# EAGLE schematic Avionics_Main_Board (EAGLE 9.1.1)

## Sheet 1 of 3
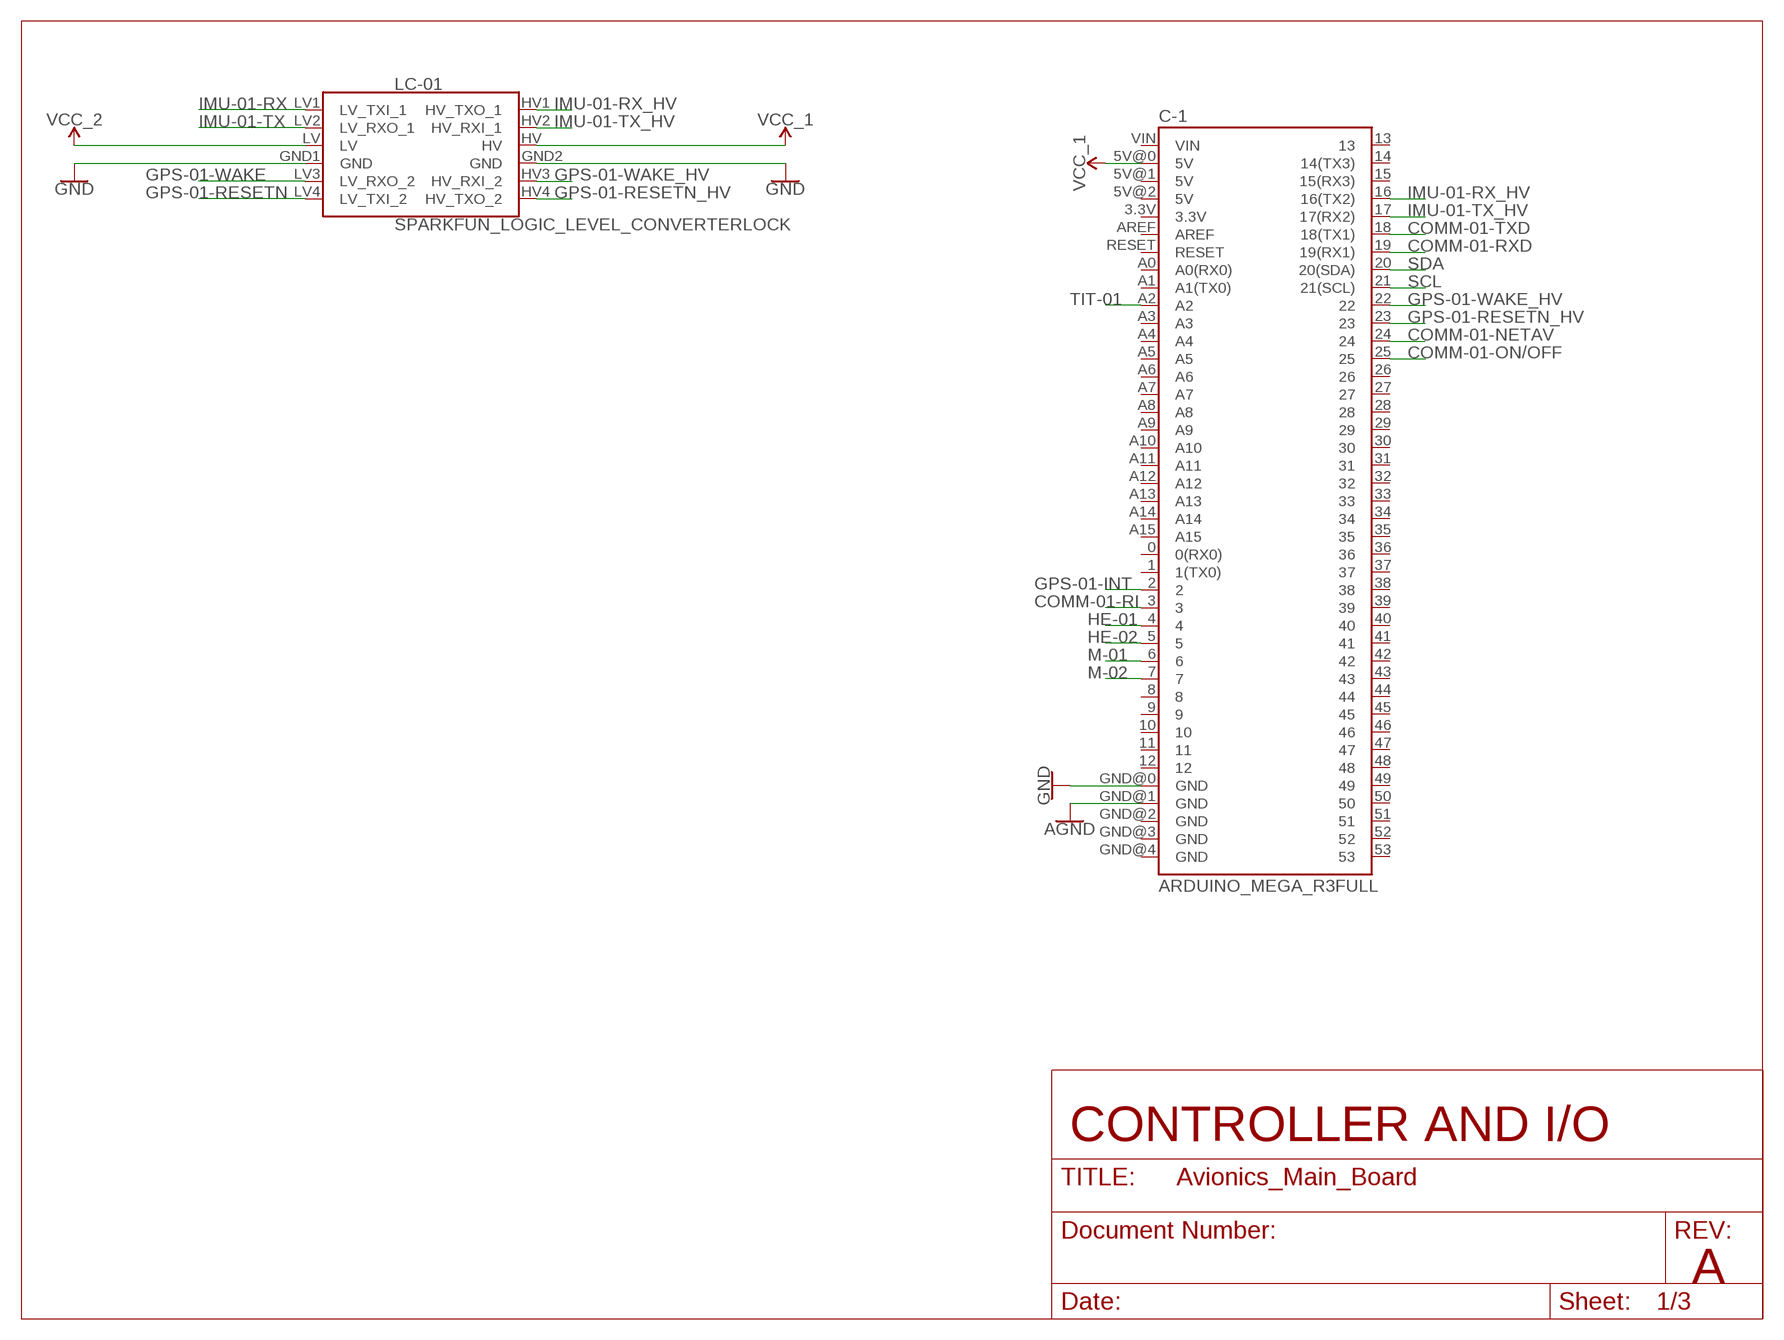
[diagram p0: schematic, sheet 1]

### Parts
C-1  ARDUINO_MEGA_R3FULL  [ARDUINO_MEGA]
LC-01  SPARKFUN_LOGIC_LEVEL_CONVERTERLOCK  [SPARKFUN_LOGIC_LEVEL_CONVERTER_LOCK]

### Nets
AGND: C-1.GND@1(GND) ; also sheet 3
COMM-01-NETAV: C-1.24 ; also sheet 3
COMM-01-ON/OFF: C-1.25 ; also sheet 3
COMM-01-RI: C-1.3 ; also sheet 3
COMM-01-RXD: C-1.19(19(RX1)) ; also sheet 3
COMM-01-TXD: C-1.18(18(TX1)) ; also sheet 3
GND: C-1.GND@0(GND) LC-01.GND1(GND) LC-01.GND2(GND) ; also sheet 2,3
GPS-01-INT: C-1.2 ; also sheet 3
GPS-01-RESETN: LC-01.LV4(LV_TXI_2) ; also sheet 3
GPS-01-RESETN_HV: C-1.23 LC-01.HV4(HV_TXO_2)
GPS-01-WAKE: LC-01.LV3(LV_RXO_2) ; also sheet 3
GPS-01-WAKE_HV: C-1.22 LC-01.HV3(HV_RXI_2)
HE-01: C-1.4 ; also sheet 2
HE-02: C-1.5 ; also sheet 2
IMU-01-RX: LC-01.LV1(LV_TXI_1) ; also sheet 3
IMU-01-RX_HV: C-1.16(16(TX2)) LC-01.HV1(HV_TXO_1)
IMU-01-TX: LC-01.LV2(LV_RXO_1) ; also sheet 3
IMU-01-TX_HV: C-1.17(17(RX2)) LC-01.HV2(HV_RXI_1)
M-01: C-1.6 ; also sheet 2
M-02: C-1.7 ; also sheet 2
SCL: C-1.21(21(SCL)) ; also sheet 3
SDA: C-1.20(20(SDA)) ; also sheet 3
TIT-01: C-1.A2 ; also sheet 3
VCC_1: C-1.5V@0(5V) LC-01.HV ; also sheet 2,3
VCC_2: LC-01.LV ; also sheet 2,3
Unconnected: C-1.0(0(RX0)) C-1.1(1(TX0)) C-1.3.3V C-1.5V@1(5V) C-1.5V@2(5V) C-1.8 C-1.9 C-1.10 C-1.11 C-1.12 C-1.13 C-1.14(14(TX3)) C-1.15(15(RX3)) C-1.26 C-1.27 C-1.28 C-1.29 C-1.30 C-1.31 C-1.32 C-1.33 C-1.34 C-1.35 C-1.36 C-1.37 C-1.38 C-1.39 C-1.40 C-1.41 C-1.42 C-1.43 C-1.44 C-1.45 C-1.46 C-1.47 C-1.48 C-1.49 C-1.50 C-1.51 C-1.52 C-1.53 C-1.A0(A0(RX0)) C-1.A1(A1(TX0)) C-1.A3 C-1.A4 C-1.A5 C-1.A6 C-1.A7 C-1.A8 C-1.A9 C-1.A10 C-1.A11 C-1.A12 C-1.A13 C-1.A14 C-1.A15 C-1.AREF C-1.GND@2(GND) C-1.GND@3(GND) C-1.GND@4(GND) C-1.RESET C-1.VIN

### Notes on the sheet
- CONTROLLER AND I/O
- A

## Sheet 2 of 3
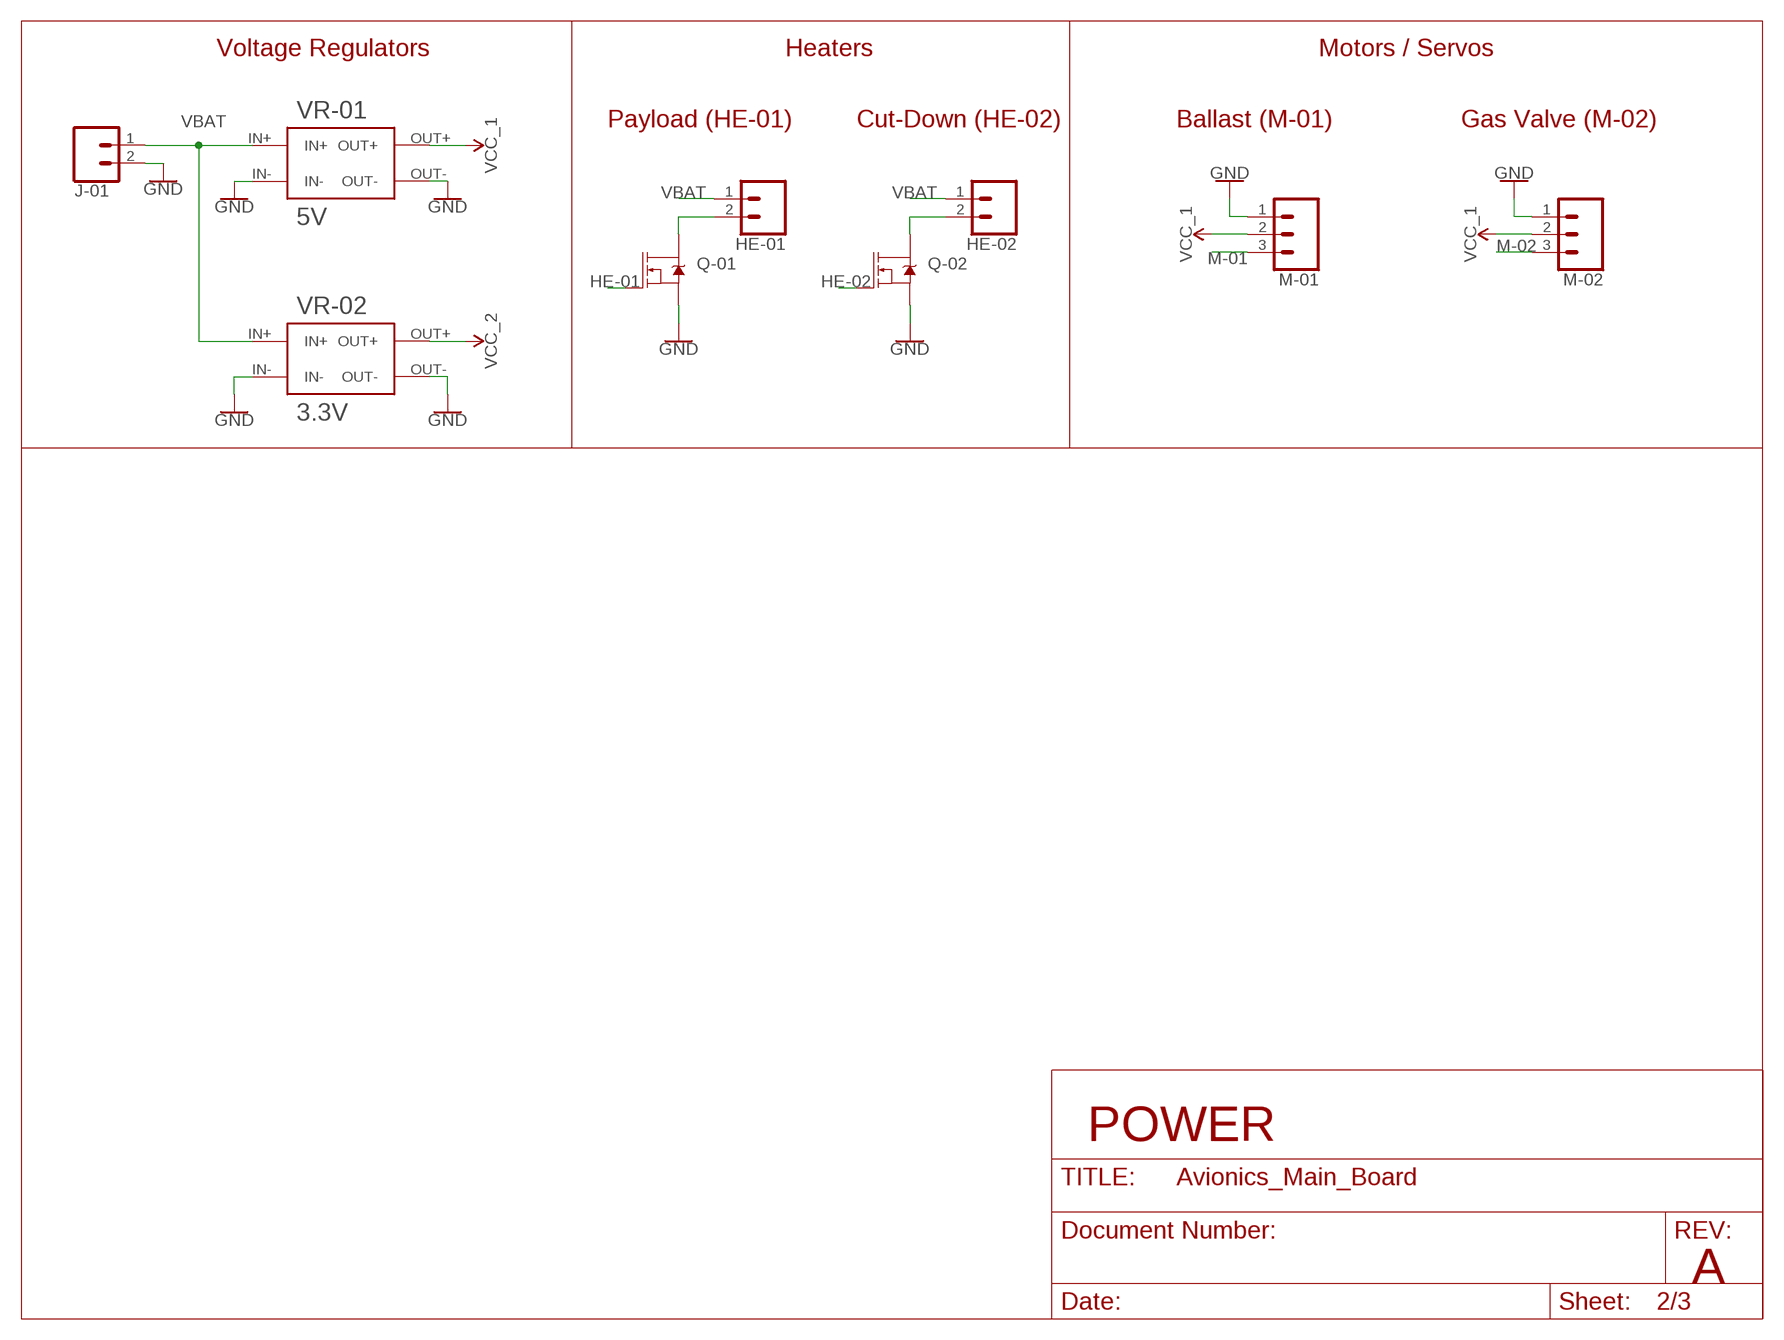
[diagram p1: schematic, sheet 2]

### Parts
HE-01  CONN_02LOCK  [1X02_LOCK]
HE-02  CONN_02LOCK  [1X02_LOCK]
J-01  CONN_023.5MM_LOCK  [SCREWTERMINAL-3.5MM-2_LOCK]
M-01  CONN_03LOCK  [1X03_LOCK]
M-02  CONN_03LOCK  [1X03_LOCK]
Q-01  MOSFET-NCH-FQP30N06L  [TO220V]
Q-02  MOSFET-NCH-FQP30N06L  [TO220V]
VR-01  5V  RIORAND_LM2596_BREAKOUT  [RIORAND_LM2596_BREAKOUT]
VR-02  3.3V  RIORAND_LM2596_BREAKOUT  [RIORAND_LM2596_BREAKOUT]

### Nets
GND: J-01.2 Q-01.3(S) Q-02.3(S) VR-01.IN- VR-01.OUT- VR-02.IN- VR-02.OUT- ; also sheet 1,3
HE-01: Q-01.1(G) ; also sheet 1
HE-02: Q-02.1(G) ; also sheet 1
M-01: M-01.3 ; also sheet 1
M-02: M-02.3 ; also sheet 1
N$1: HE-01.2 Q-01.2(D)
N$2: HE-02.2 Q-02.2(D)
N$3: M-01.1 ; supply symbol labelled GND
N$4: M-01.2 ; supply symbol labelled VCC_1
N$6: M-02.2 ; supply symbol labelled VCC_1
N$7: M-02.1 ; supply symbol labelled GND
VBAT: HE-01.1 HE-02.1 J-01.1 VR-01.IN+ VR-02.IN+
VCC_1: VR-01.OUT+ ; also sheet 1,3
VCC_2: VR-02.OUT+ ; also sheet 1,3

### Notes on the sheet
- Voltage Regulators | Heaters | Motors / Servos
- Payload (HE-01) | Cut-Down (HE-02) | Ballast (M-01) | Gas Valve (M-02)
- POWER
- A

## Sheet 3 of 3
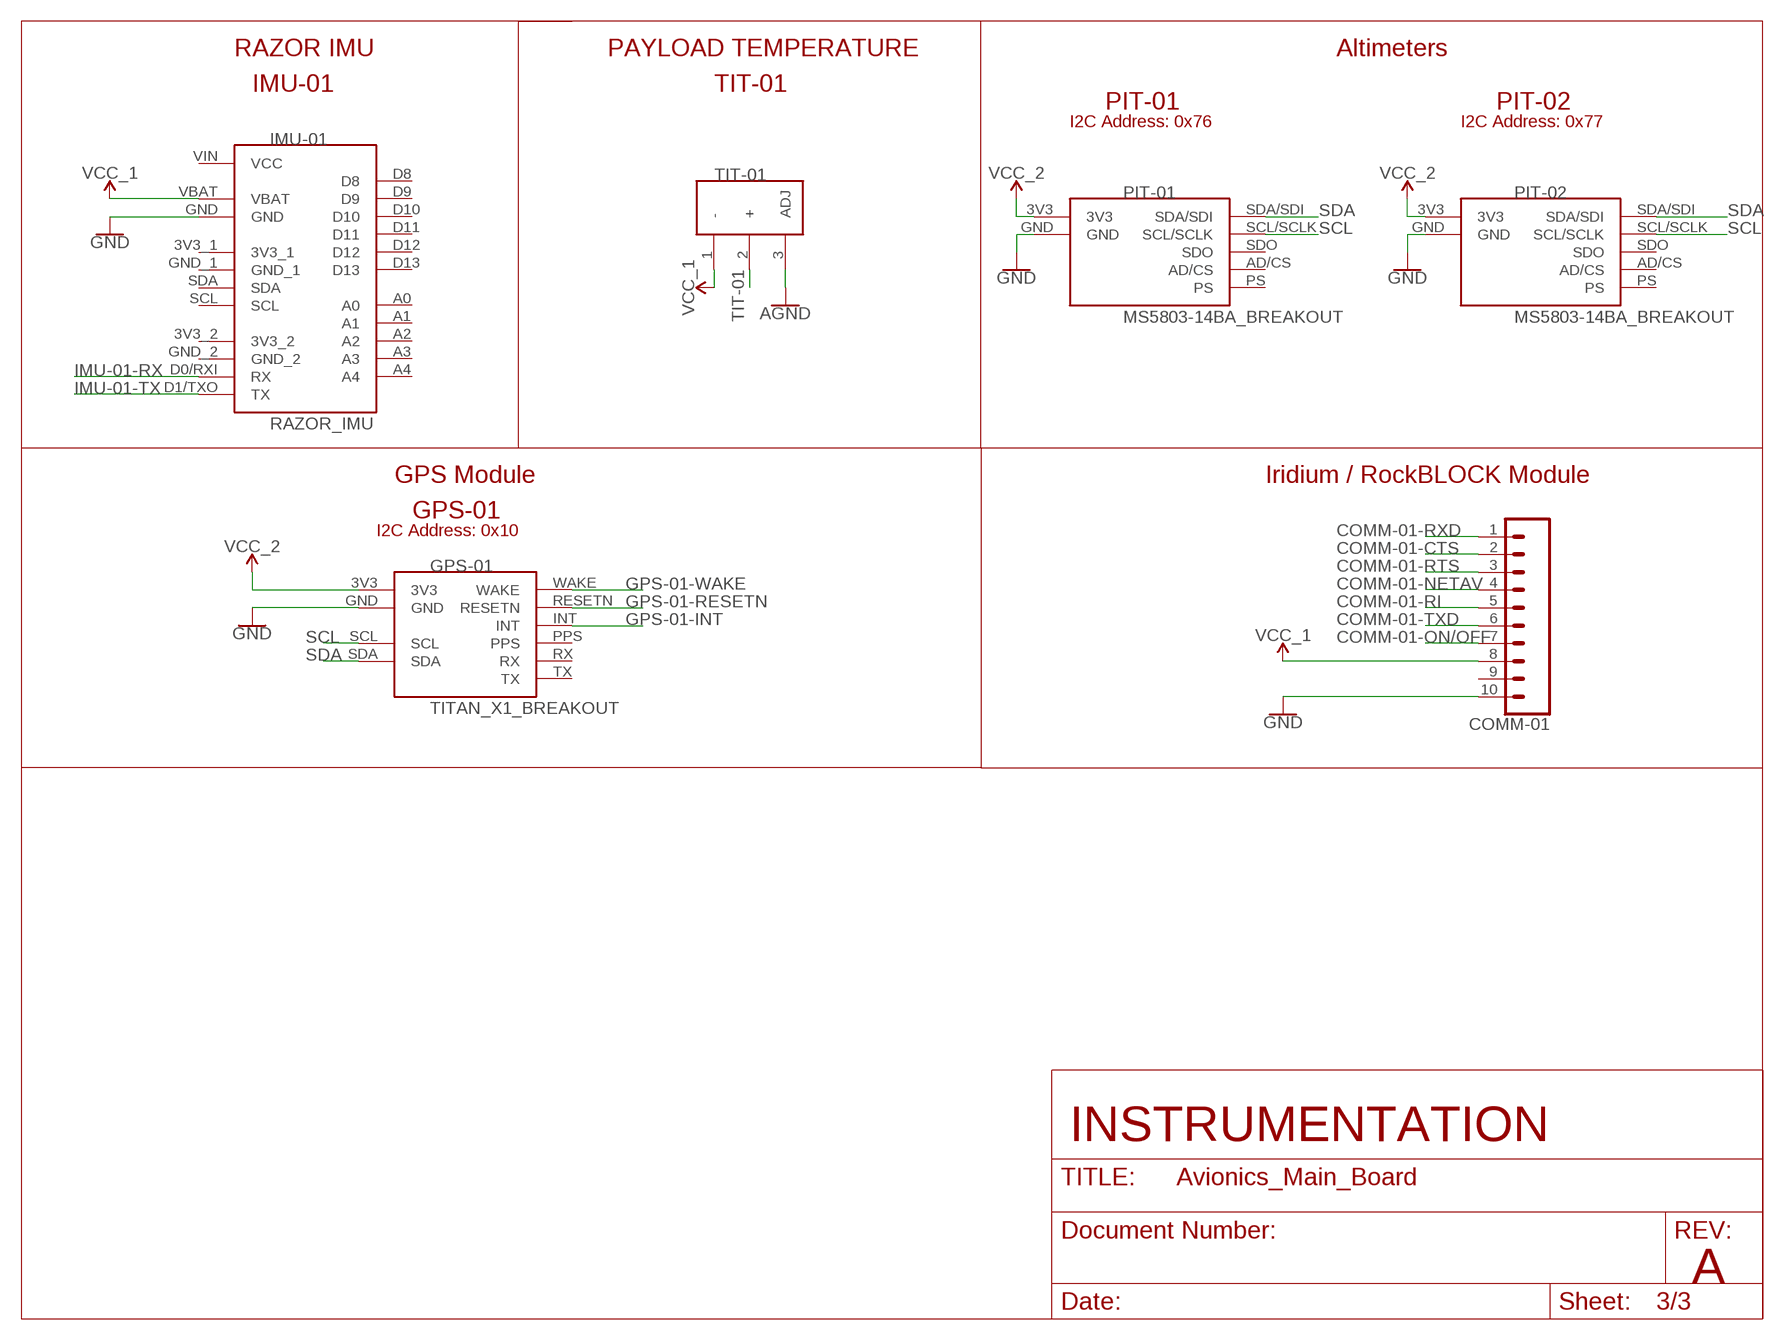
[diagram p2: schematic, sheet 3]

### Parts
COMM-01  CONN_10"  [1X10]
GPS-01  TITAN_X1_BREAKOUT  [QWIIC_TITAN_X1_BREAKOUT]
IMU-01  RAZOR_IMU  [RAZOR_IMU]
PIT-01  MS5803-14BA_BREAKOUT  [MS5803-14BA_BREAKOUT]
PIT-02  MS5803-14BA_BREAKOUT  [MS5803-14BA_BREAKOUT]
TIT-01  LM335TO-92  [TO92]

### Nets
AGND: TIT-01.3(ADJ) ; also sheet 1
COMM-01-CTS: COMM-01.2
COMM-01-NETAV: COMM-01.4 ; also sheet 1
COMM-01-ON/OFF: COMM-01.7 ; also sheet 1
COMM-01-RI: COMM-01.5 ; also sheet 1
COMM-01-RTS: COMM-01.3
COMM-01-RXD: COMM-01.1 ; also sheet 1
COMM-01-TXD: COMM-01.6 ; also sheet 1
GND: COMM-01.10 GPS-01.GND IMU-01.GND PIT-01.GND PIT-02.GND ; also sheet 1,2
GPS-01-INT: GPS-01.INT ; also sheet 1
GPS-01-RESETN: GPS-01.RESETN ; also sheet 1
GPS-01-WAKE: GPS-01.WAKE ; also sheet 1
IMU-01-RX: IMU-01.D0/RXI(RX) ; also sheet 1
IMU-01-TX: IMU-01.D1/TXO(TX) ; also sheet 1
SCL: GPS-01.SCL PIT-01.SCL/SCLK PIT-02.SCL/SCLK ; also sheet 1
SDA: GPS-01.SDA PIT-01.SDA/SDI PIT-02.SDA/SDI ; also sheet 1
TIT-01: TIT-01.2(+) ; also sheet 1
VCC_1: COMM-01.8 IMU-01.VBAT TIT-01.1(-) ; also sheet 1,2
VCC_2: GPS-01.3V3 PIT-01.3V3 PIT-02.3V3 ; also sheet 1,2
Unconnected: COMM-01.9 GPS-01.PPS GPS-01.RX GPS-01.TX IMU-01.3V3_1 IMU-01.3V3_2 IMU-01.A0 IMU-01.A1 IMU-01.A2 IMU-01.A3 IMU-01.A4 IMU-01.D8 IMU-01.D9 IMU-01.D10 IMU-01.D11 IMU-01.D12 IMU-01.D13 IMU-01.GND_1 IMU-01.GND_2 IMU-01.SCL IMU-01.SDA IMU-01.VIN(VCC) PIT-01.AD/CS PIT-01.PS PIT-01.SDO PIT-02.AD/CS PIT-02.PS PIT-02.SDO

### Notes on the sheet
- RAZOR IMU | PAYLOAD TEMPERATURE | Altimeters
- IMU-01 | TIT-01
- PIT-01 | PIT-02
- I2C Address: 0x76 | I2C Address: 0x77
- GPS Module | Iridium / RockBLOCK Module
- GPS-01
- I2C Address: 0x10
- INSTRUMENTATION
- A

## Library data of the parts
C-1 = SparkFun-Boards:ARDUINO_MEGA_R3: Arduino Mega R3 ATmega2560 R3 compatible footprint. SparkFun Products: Arduino Mega 2560 R3 <https://www.sparkfun.com/products/11061>
COMM-01 = SparkFun-Connectors:CONN_10: Multi connection point. Often used as Generic Header-pin footprint for 0.1 inch spaced/style header connections On any of the 0.1 inch spaced packages, you can populate with these: Break Away Headers - Straight <https://www.sparkfun.com/products/116> (PRT-00116) Break Away Male Headers - Right Angle <https://www.sparkfun.com/products/553> (PRT-00553) Female Headers <https://www.sparkfun.com/products/115> (PRT-00115) Break Away Headers - Machine Pin <https://www.sparkfun.com/products/117> (PRT-00117) Break Away Female Headers - Swiss Machine Pin <https://www.sparkfun.com/products/743> (PRT-00743) Arduino Stackable Header - 10 Pin <https://www.sparkfun.com/products/11376> (PRT-11376) For SCREWTERMINALS and SPRING TERMINALS visit here: Screw Terimnals on SparkFun.com <https://www.sparkfun.com/search/results?term=Screw+Terminals> (5mm/3.5mm/2.54mm spacing) This device is also useful as a general connection point to wire up your design to another part of your project. Our various solder wires solder well into these plated through hole pads. Hook-Up Wire - Assortment (Stranded, 22 AWG) <https://www.sparkfun.com/products/11375> (PRT-11375) Hook-Up Wire - Assortment (Solid Core, 22 AWG) <https://www.sparkfun.com/products/11367> (PRT-11367) View the entire wire category on our website here <https://www.sparkfun.com/categories/141> Special notes: Molex polarized connector foot print use with SKU : PRT-08231 with associated crimp pins and housings. 1MM SMD Version SKU: PRT-10208 NOTES ON THE VARIANTS LOCK and LOCK_LONGPADS... This footprint was designed to help hold the alignment of a through-hole component (i.e. 6-pin header) while soldering it into place. You may notice that each hole has been shifted either up or down by 0.005 of an inch from it's more standard position (which is a perfectly straight line). This slight alteration caused the pins (the squares in the middle) to touch the edges of the holes. Because they are alternating, it causes a "brace" to hold the component in place. 0.005 has proven to be the perfect amount of "off-center" position when using our standard breakaway headers. Although looks a little odd when you look at the bare footprint, once you have a header in there, the alteration is very hard to notice. Also,if you push a header all the way into place, it is covered up entirely on the bottom side.; PROD_ID: CONN-11563
GPS-01 = High Ball Library:TITAN_X1_BREAKOUT
HE-01 HE-02 = SparkFun-Connectors:CONN_02: Multi connection point. Often used as Generic Header-pin footprint for 0.1 inch spaced/style header connections On any of the 0.1 inch spaced packages, you can populate with these: Break Away Headers - Straight <https://www.sparkfun.com/products/116> (PRT-00116) Break Away Male Headers - Right Angle <https://www.sparkfun.com/products/553> (PRT-00553) Female Headers <https://www.sparkfun.com/products/115> (PRT-00115) Break Away Headers - Machine Pin <https://www.sparkfun.com/products/117> (PRT-00117) Break Away Female Headers - Swiss Machine Pin <https://www.sparkfun.com/products/743> (PRT-00743) For SCREWTERMINALS and SPRING TERMINALS visit here: Screw Terimnals on SparkFun.com <https://www.sparkfun.com/search/results?term=Screw+Terminals> (5mm/3.5mm/2.54mm spacing) This device is also useful as a general connection point to wire up your design to another part of your project. Our various solder wires solder well into these plated through hole pads. Hook-Up Wire - Assortment (Stranded, 22 AWG) <https://www.sparkfun.com/products/11375> (PRT-11375) Hook-Up Wire - Assortment (Solid Core, 22 AWG) <https://www.sparkfun.com/products/11367> (PRT-11367) View the entire wire category on our website here <https://www.sparkfun.com/categories/141> Special notes: Molex polarized connector foot print use with: PRT-08233 with associated crimp pins and housings. 2.54_SCREWTERM for use with PRT-10571. 3.5mm Screw Terminal footprints for PRT-08084 5mm Screw Terminal footprints for use with PRT-08432
IMU-01 = High Ball Library:RAZOR_IMU
J-01 = SparkFun-Connectors:CONN_02: Multi connection point. Often used as Generic Header-pin footprint for 0.1 inch spaced/style header connections On any of the 0.1 inch spaced packages, you can populate with these: Break Away Headers - Straight <https://www.sparkfun.com/products/116> (PRT-00116) Break Away Male Headers - Right Angle <https://www.sparkfun.com/products/553> (PRT-00553) Female Headers <https://www.sparkfun.com/products/115> (PRT-00115) Break Away Headers - Machine Pin <https://www.sparkfun.com/products/117> (PRT-00117) Break Away Female Headers - Swiss Machine Pin <https://www.sparkfun.com/products/743> (PRT-00743) For SCREWTERMINALS and SPRING TERMINALS visit here: Screw Terimnals on SparkFun.com <https://www.sparkfun.com/search/results?term=Screw+Terminals> (5mm/3.5mm/2.54mm spacing) This device is also useful as a general connection point to wire up your design to another part of your project. Our various solder wires solder well into these plated through hole pads. Hook-Up Wire - Assortment (Stranded, 22 AWG) <https://www.sparkfun.com/products/11375> (PRT-11375) Hook-Up Wire - Assortment (Solid Core, 22 AWG) <https://www.sparkfun.com/products/11367> (PRT-11367) View the entire wire category on our website here <https://www.sparkfun.com/categories/141> Special notes: Molex polarized connector foot print use with: PRT-08233 with associated crimp pins and housings. 2.54_SCREWTERM for use with PRT-10571. 3.5mm Screw Terminal footprints for PRT-08084 5mm Screw Terminal footprints for use with PRT-08432; PROD_ID: CONN-08399
LC-01 = SparkFun-Boards:SPARKFUN_LOGIC_LEVEL_CONVERTER: SparkFun Logic Level Converter -Bi-Directional This is the mechnical outline for the 3.3V - 5V bi directional logic level converter. *Note, the "LOCK" Package has the header pins staggered by an offset of 5 mils (off center line), so that when you slide a row of standard 0.1" headers into the PTH pads, it will hold position vertically. See the follwing turorial for more information on this type of special footprints: Sneaky Footprints <https://www.sparkfun.com/tutorials/114> SparkFun Products: SparkFun Logic Level Converter - Bi-Directional <https://www.sparkfun.com/products/12009>
M-01 M-02 = SparkFun-Connectors:CONN_03: Multi connection point. Often used as Generic Header-pin footprint for 0.1 inch spaced/style header connections On any of the 0.1 inch spaced packages, you can populate with these: Break Away Headers - Straight <https://www.sparkfun.com/products/116> (PRT-00116) Break Away Male Headers - Right Angle <https://www.sparkfun.com/products/553> (PRT-00553) Female Headers <https://www.sparkfun.com/products/115> (PRT-00115) Break Away Headers - Machine Pin <https://www.sparkfun.com/products/117> (PRT-00117) Break Away Female Headers - Swiss Machine Pin <https://www.sparkfun.com/products/743> (PRT-00743) Stackable Header - 3 Pin (Female, 0.1") <https://www.sparkfun.com/products/13875> (PRT-13875) For SCREWTERMINALS and SPRING TERMINALS visit here: Screw Terimnals on SparkFun.com <https://www.sparkfun.com/search/results?term=Screw+Terminals> (5mm/3.5mm/2.54mm spacing) This device is also useful as a general connection point to wire up your design to another part of your project. Our various solder wires solder well into these plated through hole pads. Hook-Up Wire - Assortment (Stranded, 22 AWG) <https://www.sparkfun.com/products/11375> (PRT-11375) Hook-Up Wire - Assortment (Solid Core, 22 AWG) <https://www.sparkfun.com/products/11367> (PRT-11367) View the entire wire category on our website here <https://www.sparkfun.com/categories/141> Special notes: Molex polarized connector foot print use with SKU : PRT-08232 with associated crimp pins and housings.
PIT-01 PIT-02 = High Ball Library:MS5803-14BA_BREAKOUT
Q-01 Q-02 = SparkFun-DiscreteSemi:MOSFET-NCH: N-channel MOSFETs Voltage controlled devices that allow control of high current outputs. SparkFun Products: SparkFun OpenScale <https://www.sparkfun.com/products/13261> SparkFun Digital Sandbox <https://www.sparkfun.com/products/12651> SparkFun Monster Moto Shield <https://www.sparkfun.com/products/10182> SparkFun MOSFET Power Controller <https://www.sparkfun.com/products/11214>; PROD_ID: TRANS-10060; VALUE: 60V/32A/35mΩ
TIT-01 = High Ball Library:LM335
VR-01 VR-02 = High Ball Library:RIORAND_LM2596_BREAKOUT